# Altium schematic sheet Управление (дисплей+клавиатура).SchDoc
size 420 x 297 mm; SheetNumber: 1; SheetTotal: 2
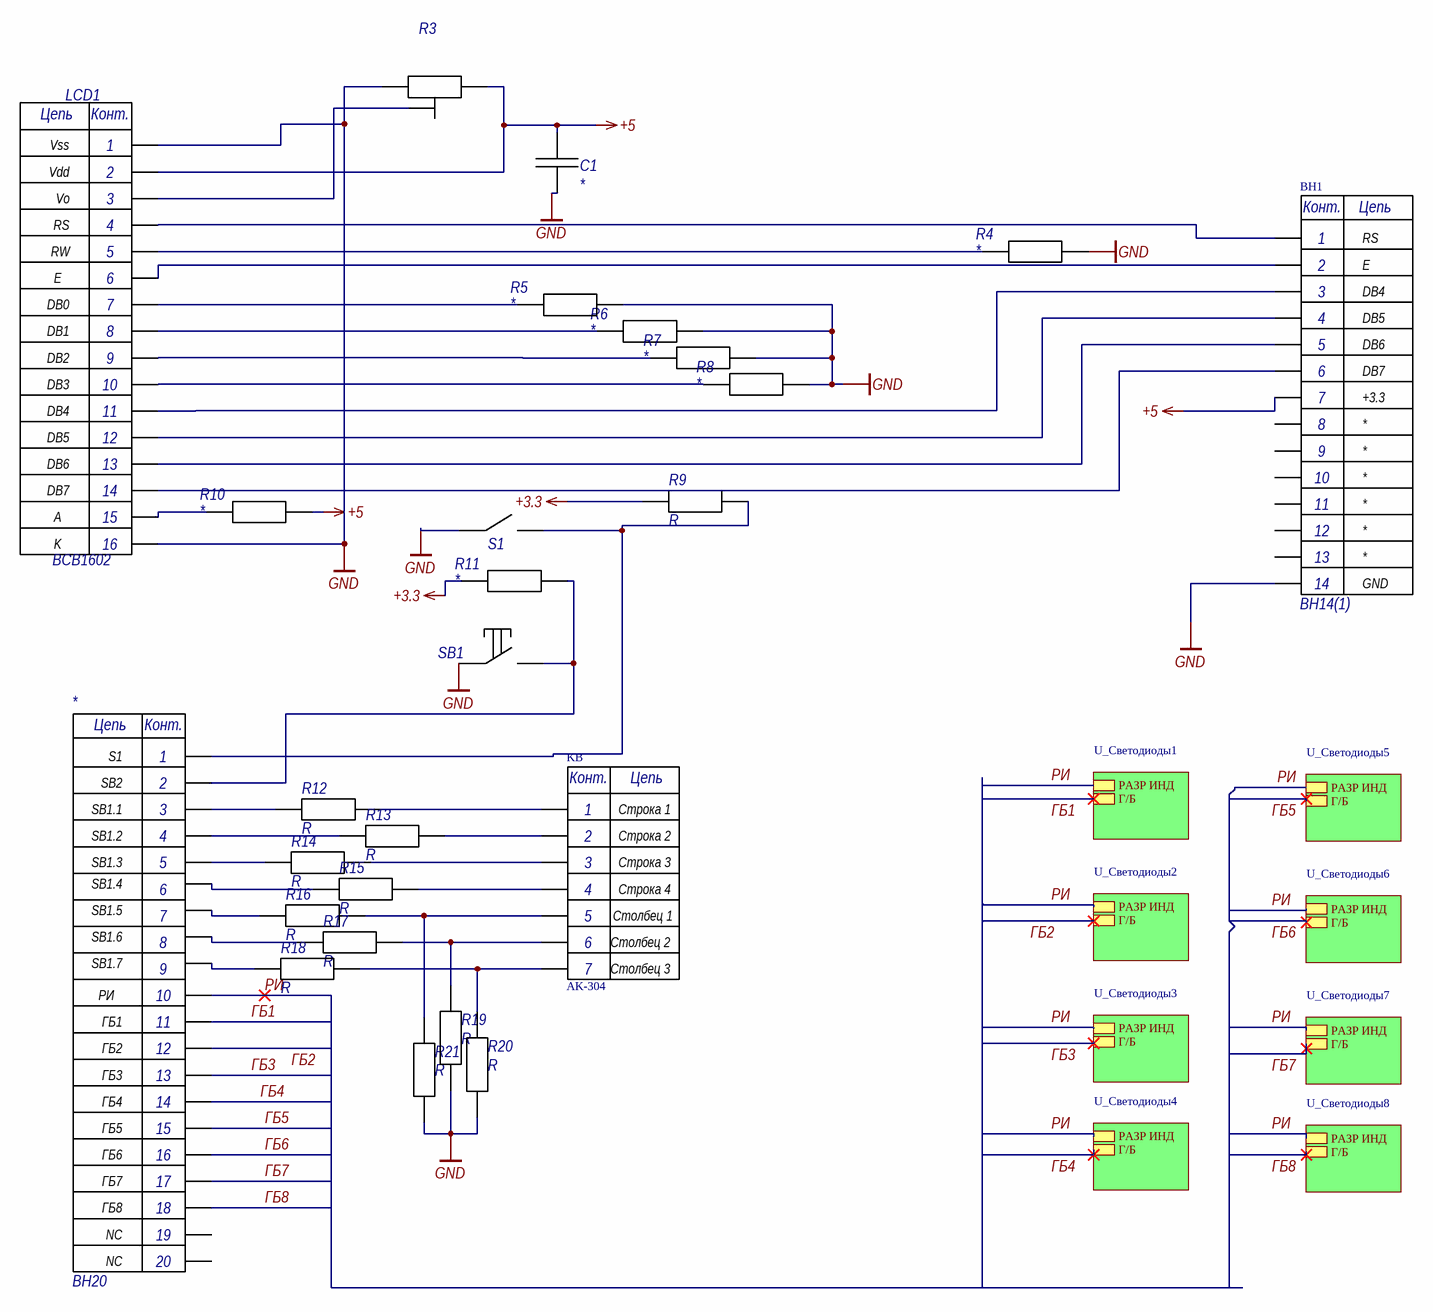
[diagram p0: Управление (дисплей+клавиатура).SchDoc]

## Parts
*  BH20  [IDC20]
BH1  BH14(1)  [BH-14 (DS1013-14S) (IDC-14MS)]
C1  *  [C(ceramic)]
KB  AK-304  [AK-304-N-BBW]
LCD1  BCB1602  [BCB1602]
R3  (no value)  [R(подстр)]
R4  *  [R]
R5  *  [R]
R6  *  [R]
R7  *  [R]
R8  *  [R]
R9  R  [R]
R10  *  [R]
R11  *  [R]
R12  R  [R]
R13  R  [R]
R14  R  [R]
R15  R  [R]
R16  R  [R]
R17  R  [R]
R18  R  [R]
R19  R  [R]
R20  R  [R]
R21  R  [R]
S1  (?)тумблер  [MTS-2]  (value not drawn)
SB1  ПУСК  [кнопка]  (value not drawn)

## Sub-sheets
U_Светодиоды1 = СВЕТОДИОДЫ.SchDoc: РАЗР ИНД, Г/Б
U_Светодиоды2 = СВЕТОДИОДЫ.SchDoc: РАЗР ИНД, Г/Б
U_Светодиоды3 = СВЕТОДИОДЫ.SchDoc: РАЗР ИНД, Г/Б
U_Светодиоды4 = СВЕТОДИОДЫ.SchDoc: РАЗР ИНД, Г/Б
U_Светодиоды5 = СВЕТОДИОДЫ.SchDoc: РАЗР ИНД, Г/Б
U_Светодиоды6 = СВЕТОДИОДЫ.SchDoc: РАЗР ИНД, Г/Б
U_Светодиоды7 = СВЕТОДИОДЫ.SchDoc: РАЗР ИНД, Г/Б
U_Светодиоды8 = СВЕТОДИОДЫ.SchDoc: РАЗР ИНД, Г/Б

## Nets
+3.3: R9.1 R11.1
+5: BH1.7(+3.3) C1.2 LCD1.2(Vdd) R3.1 R10.2
GND: BH1.14(GND) C1.1 LCD1.1(Vss) LCD1.16(K) R3.2 R4.2 R5.2 R6.2 R7.2 R8.2 R19.1 R20.1 R21.1 S1.1 SB1.1
ГБ1: *.11(ГБ1) ; sheet U_Светодиоды1/Г/Б
ГБ2: *.12(ГБ2) ; sheet U_Светодиоды2/Г/Б
ГБ3: *.13(ГБ3) ; sheet U_Светодиоды3/Г/Б
ГБ4: *.14(ГБ4) ; sheet U_Светодиоды4/Г/Б
ГБ5: *.15(ГБ5) ; sheet U_Светодиоды5/Г/Б
ГБ6: *.16(ГБ6) ; sheet U_Светодиоды6/Г/Б
ГБ7: *.17(ГБ7) ; sheet U_Светодиоды7/Г/Б
ГБ8: *.18(ГБ8) ; sheet U_Светодиоды8/Г/Б
РИ: *.10(РИ) ; sheet U_Светодиоды1/РАЗР ИНД, sheet U_Светодиоды5/РАЗР ИНД, sheet U_Светодиоды6/РАЗР ИНД, sheet U_Светодиоды7/РАЗР ИНД, sheet U_Светодиоды8/РАЗР ИНД, sheet U_Светодиоды3/РАЗР ИНД, sheet U_Светодиоды4/РАЗР ИНД, sheet U_Светодиоды2/РАЗР ИНД
Net*_1: *.1(S1) R9.2 S1.2
Net*_2: *.2(SB2) R11.2 SB1.2
Net*_3: *.3(SB1.1) R12.1
Net*_4: *.4(SB1.2) R13.1
Net*_5: *.5(SB1.3) R14.1
Net*_6: *.6(SB1.4) R15.1
Net*_7: *.7(SB1.5) R16.1
Net*_8: *.8(SB1.6) R17.1
Net*_9: *.9(SB1.7) R18.1
NetBH1_1: BH1.1(RS) LCD1.4(RS)
NetBH1_2: BH1.2(E) LCD1.6(E)
NetBH1_3: BH1.3(DB4) LCD1.11(DB4)
NetBH1_4: BH1.4(DB5) LCD1.12(DB5)
NetBH1_5: BH1.5(DB6) LCD1.13(DB6)
NetBH1_6: BH1.6(DB7) LCD1.14(DB7)
NetKB_1: KB.1(Строка_1) R12.2
NetKB_2: KB.2(Строка_2) R13.2
NetKB_3: KB.3(Строка_3) R14.2
NetKB_4: KB.4(Строка_4) R15.2
NetKB_5: KB.5(Столбец_1) R16.2 R21.2
NetKB_6: KB.6(Столбец_2) R17.2 R19.2
NetKB_7: KB.7(Столбец_3) R18.2 R20.2
NetLCD1_3: LCD1.3(Vo) R3.3
NetLCD1_5: LCD1.5(RW) R4.1
NetLCD1_7: LCD1.7(DB0) R5.1
NetLCD1_8: LCD1.8(DB1) R6.1
NetLCD1_9: LCD1.9(DB2) R7.1
NetLCD1_10: LCD1.10(DB3) R8.1
NetLCD1_15: LCD1.15(A) R10.1

Not connected (* = marked no-connect by the designer): * 19(NC) 20(NC); BH1 8(*) 9(*) 10(*) 11(*) 12(*) 13(*)

## Notes on the sheet
- Подп. дата
- Инв. № дубл.
- Взам. инв. №
- Подп. и дата
- Инв. № подл.
- Изм.
- Лист
- № докум.
- Подп.
- Дата
- ALTIUM GOSTBOM2.0 KEV
- Файл:
- Копировал
- Формат А3
- (in symbol AK-304) Конт.; Цепь
- (in symbol BCB1602) Цепь; Конт.
- (in symbol BH14(3)) Конт.; Цепь
- (in symbol BH20) Цепь; Конт.

## Library data of the parts
BH1 = BH14(3)
C1 = C(ceramic)
R3 = R(подстр)
R4-R8 R10 R11 = R
SB1 = кнопка